# Altium schematic sheet GTM_I2Cconnector.SchDoc
size A4
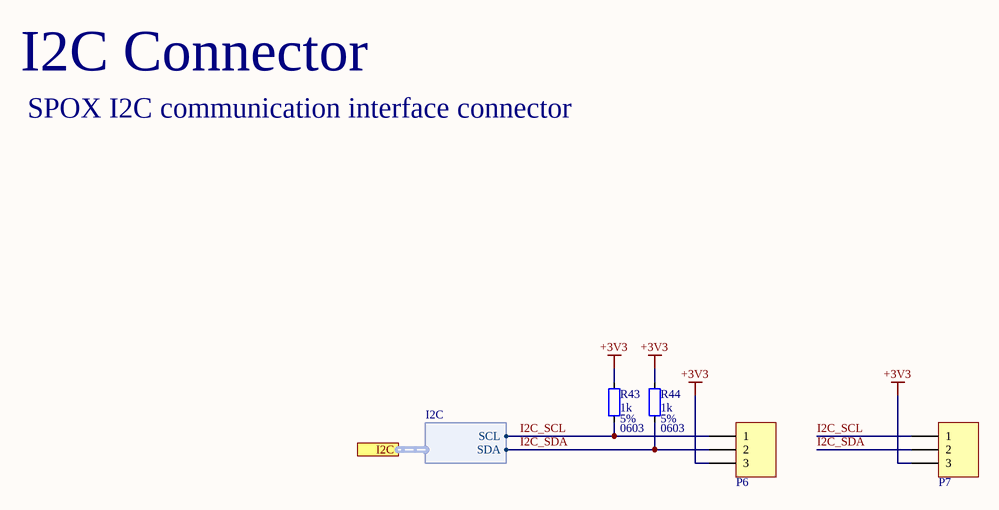
[diagram p0: GTM_I2Cconnector.SchDoc]

## Parts
P6  HDR1X3  [Molex SPOX Horizontal 3 Circuits]  (value not drawn)
P7  HDR1X3  [Molex SPOX Horizontal 3 Circuits]  (value not drawn)
R43  Tolerance: 5%  [0603]  (hidden comment: 1k)
R44  Tolerance: 5%  [0603]  (hidden comment: 1k)

## Ports
I2C (harness I2C)

## Harnesses
I2C: SCL, SDA

## Nets
+3V3: P6.3 P7.3 R43.2 R44.2
I2C_SCL: P6.1 P7.1 R43.1 ; port I2C.SCL
I2C_SDA: P6.2 P7.2 R44.1 ; port I2C.SDA

## Notes on the sheet
- I2C Connector
- SPOX I2C communication interface connector
- Project
- Rev.
- Title
- Drawn by
- Date
- Sheet
- of
- Checked by

## Library data of the parts
P6 = HDR1X3: Header, 3-Pin; LatestRevisionDate: 17-Jul-2002; LatestRevisionNote: Re-released for DXP Platform.; Publisher: Altium Limited
P7 = HDR1X3: Doubled Ceonnector; LatestRevisionDate: 17-Jul-2002; LatestRevisionNote: Re-released for DXP Platform.; Publisher: Altium Limited
R43 R44 = RES: Resistior; Value: 1k; Package: 0603